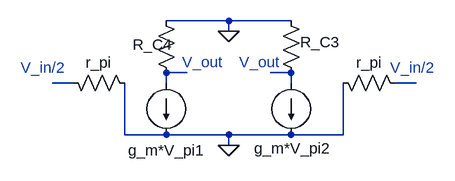
[diagram p0: schematic differential_stage_v2.asc]
differential_stage_v2.asc, the LTspice schematic file:
Version 4
SHEET 1 880 680
WIRE 224 16 128 16
WIRE 320 16 224 16
WIRE 224 32 224 16
WIRE 160 96 128 96
WIRE 320 96 288 96
WIRE -16 112 -48 112
WIRE 128 112 128 96
WIRE 320 112 320 96
WIRE 512 112 480 112
WIRE 64 192 64 112
WIRE 128 192 64 192
WIRE 224 192 128 192
WIRE 320 192 224 192
WIRE 400 192 400 112
WIRE 400 192 320 192
WIRE 224 208 224 192
FLAG 224 32 0
FLAG 224 208 0
SYMBOL res -32 96 M90
WINDOW 0 0 56 VBottom 2
WINDOW 3 32 56 VTop 2
SYMATTR InstName r_pi
SYMATTR Value ""
SYMBOL res 384 96 M90
WINDOW 0 0 56 VBottom 2
WINDOW 3 32 56 VTop 2
SYMATTR InstName r_pi
SYMATTR Value ""
SYMBOL current 128 112 R0
WINDOW 0 -59 104 Left 2
SYMATTR InstName g_m*V_pi1
SYMATTR Value ""
SYMBOL current 320 112 R0
WINDOW 0 -57 101 Left 2
SYMATTR InstName g_m*V_pi2
SYMATTR Value ""
SYMBOL res 112 0 R0
WINDOW 0 -36 53 Left 2
SYMATTR InstName R_C4
SYMATTR Value ""
SYMBOL res 304 0 R0
WINDOW 0 30 49 Left 2
SYMATTR InstName R_C3
SYMATTR Value ""
TEXT -96 88 Left 2 ;V_in/2
TEXT 472 88 Left 2 ;V_in/2
TEXT 152 80 Left 2 ;V_out
TEXT 240 80 Left 2 ;V_out

The netlist it stands for:
* differential_stage_v2.asc
r_pi N003 0
r_pi 0 N004
I§g_m*V_pi1 N001 0
I§g_m*V_pi2 N002 0
R_C4 0 N001
R_C3 0 N002
* V_in/2
* V_in/2
* V_out
* V_out
.backanno
.end